# Altium schematic sheet HA_Power.SchDoc: transc
size A4; Date: 11/21/2016 9:12:52 PM; SheetNumber: 2; PageSetup: Record=PageOptions|CenterHorizontal=True|CenterVertical=True|PrintScale=0.98|XCorrection=1.00|YCorrection=1.00|PrintKind=0|BorderSize=5000000|LeftOffset=0|BottomOffset=0|Orientation=2|PaperLength=1000|PaperWidth=1000|Scale=100|PaperSource=7|PrintQuality=-3|MediaType=1|DitherType=10|PrintScaleMode=1|PaperKind=A4|PaperIndex=9
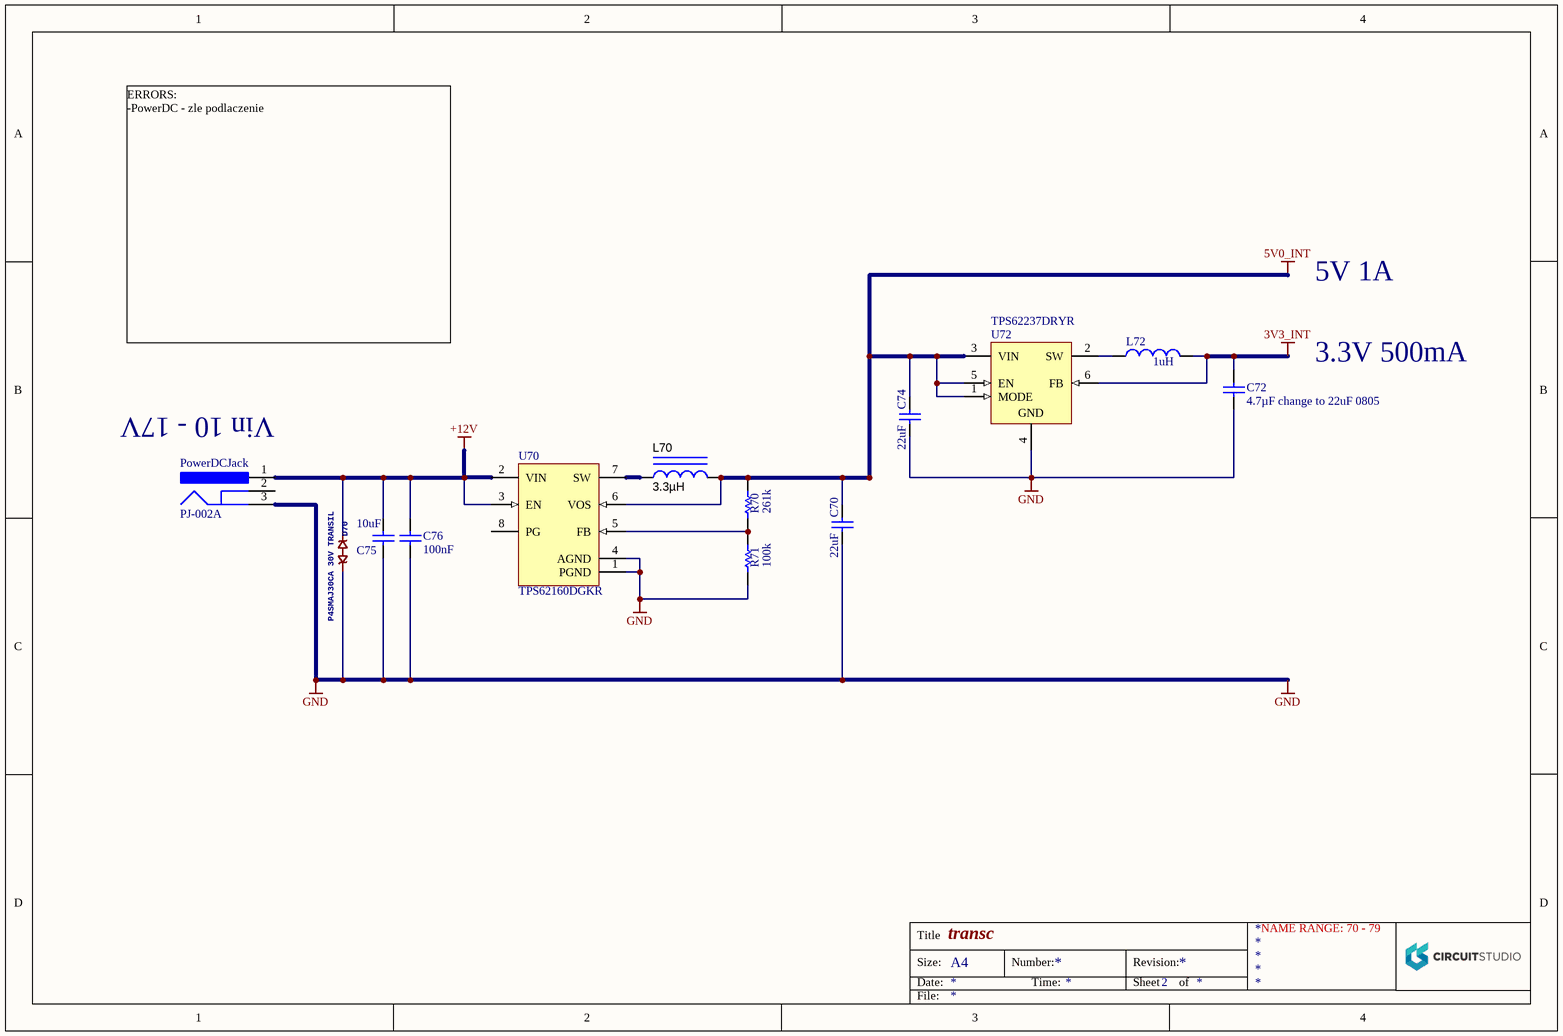
[diagram p0: HA_Power.SchDoc]

## Parts
C70  value 22uF  [CAPC0805(2012)75_N]  (hidden comment: 22uF 10V)
C72  Capacitance: 4.7µF change to 22uF 0805  [CAPC1608X95X30NL15T20]  (hidden comment: 4.7uF CL10B475KQ8NQNC)
C74  value 22uF  [CAPC0805(2012)75_N]  (hidden comment: 22uF 10V)
C75  value 10uF  [CAPC1206(3216)190_N]  (hidden comment: 10uF 35V)
C76  value 100nF  [CAPC0603(1608)100_L]  (hidden comment: 100nF 100V)
D70  P4SMAJ30CA 30V TRANSIL  [DO214AC_BIDIR]
L70  ValueDisplayed: 3.3µH  [XPL2010]  (hidden comment: 3.3uH XPL2010-332MLB)
L72  Inductance: 1uH  [MURA-IND0805_H_0.55_M]  (hidden comment: LQM21PN2R2MC0D)
PowerDCJack  PJ-002A  [CUI-PJ-002A_V]
R70  261k  [RESC0603(1608)_N]
R71  100k  [RESC0603(1608)_N]
U70  TPS62160DGKR  [DGK8_N]
U72  TPS62237DRYR  [DRY0006A]

## Nets
3V3_INT: C72.2 L72.2 U72.6(FB)
5V0_INT: C70.2 C74.2 L70.2 R70.2 U70.6(VOS) U72.1(MODE) U72.3(VIN) U72.5(EN)
+12V: C75.2 C76.1 D70.2 PowerDCJack.1 U70.2(VIN) U70.3(EN)
GND: C70.1 C72.1 C74.1 C75.1 C76.2 D70.1 PowerDCJack.3 R71.1 U70.1(PGND) U70.4(AGND) U72.4(GND)
NetL70_1: L70.1 U70.7(SW)
NetL72_1: L72.1 U72.2(SW)
NetR70_1: R70.1 R71.2 U70.5(FB)

Not connected (* = marked no-connect by the designer): PowerDCJack 2; U70 8(PG)

## Notes on the sheet
- 5V 1A
- ERRORS:
  -PowerDC - zle podlaczenie
- 3.3V 500mA
- (near PowerDCJack) Vin 10 - 17V
- NAME RANGE: 70 - 79
- Title
- Size:
- Date:
- A4
- Number:
- Time:
- Revision:
- Sheet
- of
- File:

## Library data of the parts
C70 C74 = CMP-1036-00417-1: Case-EIA: 0805; Tolerance: ±10%; Case-Metric: 2012; Technology: SMT; Max Thickness: 0.75 mm; Rated Voltage: 10 V
C72 = CMP-2000-06096-1: Manufacturer: Samsung Electro-Mechanics; Temperature Coefficient: X7R; Other Names: 1276-2087-2; Featured Product: Multi-LayerCeramicCapacitors; Voltage - Rated: 6.3V; Tolerance: ±10%; Product Training Modules: AutoGradeMLCCHighCapMLCCFamilySoftTerminationMLCC; Online Catalog: CLSeries,HighCapacitance; RoHS Information: MLCCRoHS2Compliance; Package / Case: 0603(1608Metric); Datasheet URL: http://media.digikey.com/pdf/Data%20Sheets/Samsung%20PDFs/CL10B475KQ8NQNC_Spec.pdf; Family: CeramicCapacitors; Category: Capacitors; Packaging: Tape&Reel(TR); Operating Temperature: -55°C~125°C; Datasheet Version: 09/2013; Lead Spacing: -; Mounting Type: SurfaceMount,MLCC; Ratings: -; Applications: GeneralPurpose; Height - Seated (Max): -; Series: CL; Package Reference: 0603; Manufacturer URL: http://www.samsungsem.com/global/index.jsp; Thickness (Max): 0.035"(0.90mm); Lead Style: -; Package Description: 2-Pin Surface Mount Device, Body 1.6 x 0.8 mm; Size / Dimension: 0.063"Lx0.031"W(1.60mmx0.80mm); Features: -; Mounting Technology: SurfaceMount; Standard Package: 4,000
C75 = CMP-1037-04990-1: CAP 1206 (3216 Metric) Thickness 1.9mm SMD; Rated Voltage: 10 V; Tolerance: Â±20%; Case-EIA: 1206; Case-Metric: 3216; Max Thickness: 1.9 mm; Technology: SMT
C76 = CMP-1035-00529-1: CAP 100nF 100V ±10% 0603 (1608 Metric) Thickness 1mm SMD; Case-Metric: 1608; Case-EIA: 0603; Rated Voltage: 100 V; Max Thickness: 1 mm; Technology: SMT; Tolerance: ±10%
D70 = DIODE_BIDIR-DO214AC
L70 = XPL2010-332MLB: XPL2010 Inductor; Manufacturer: Coilcraft; Ind_H: 3.3E-6; Imax_A: 1.05; Irms: 1.1A @ 40C rise; Isat: 1.05A @ 30% inductance drop; DCR_ohm: 0.21; Value1: 0.21 ohm; Value2: 1.05A; Material: Composite; SizeAreaWB_mm2: 8.7; SizeArea_mm2: 3.8; SizeX_mm: 2; SizeY_mm: 1.9; SizeZ_mm: 1; AEC Category: Q200; SymbolVersion: 2008-07-23; CompType: Inductor; Value: 3.3uH; PartNumber: XPL2010-332MLB; Technology: Shielded; MountType: SMT; PackageReference: XPL2010; Published: 2008-06-26; Publisher: Texas Instruments; LatestRevisionDate: 2016-12-22; ComponentLink1Description: Datasheet link; ComponentLink1URL: http://www.coilcraft.com/pdfs/xpl2010.pdf; RoHS: Y; AEC Qualified: ?
L72 = CMP-2000-06589-1: Chip Inductor, 1.0 uH, +/- 20%, -55 to 125 degC, 2-Pin SMD (0805), RoHS, Tape and Reel; Manufacturer: Murata; Rated Current-Max: 800mA; DC Resistance: 0.19; Mounting Technology: SurfaceMount; Package Reference: 0805; Tolerance (%): 20%; Datasheet Version: 07/2014; Manufacturer URL: http://www.murata.com/; Package Description: 2-Pin Surface Mounted Device, Body 2 x 1.25 mm; Case Size/Dimension: 0805; Datasheet URL: https://datasheet.ciiva.com/3866/336lqm21pn1r0mc023-3866307.pdf
PowerDCJack = CMP-2000-06895-1: Through Hole Right Angle DC Power Jack, 2.5 A, 2 mm Center Pin, 3 Position, -25 to 85 degC, RoHS, Bulk; Manufacturer: CUIInc.; Current Rating: 2.5A; Inside Contact Diameter: 2mm; Insulation Resistance: 50MOhms; Outside Contact Diameter: 6.5mm; Voltage Rating: 24V; Brand: CUI; Operating Temperature Range: -25Cto+85C; Mounting Technology: ThroughHole; Connector Type: DCPowerJack; Contact Material: Copper; Datasheet URL: http://www.cui.com/product/resource/pj-002a.pdf; Contact Gender: Male; Housing Material: PolybutyleneTerephthalate(PBT); Manufacturer URL: http://www.cui.com/; Package Reference: PJ-002A; Mounting Style: ThroughHole; Mounting Angle: Right; Product Category: DCPowerConnectors; Product: Jacks; Flammability Rating: UL94V-0; Contact Plating: Nickel; RoHS: True; Datasheet Version: Rev. 1.03, 04/2016; Package Description: 3-Pin Through Hole Device, Body 14.4 x 9 mm, Height 11 mm; Factory Pack Quantity: 500; Termination Style: ThroughHole
R70 R71 = CMP-1012-00122-1: 1% 0603 SMD; Value: 22k Ohm; Tolerance: 1 %
U70 = CMP-0323-00440-1: Buck Step Down Regulator with 3 to 17 V Input and 0.9 to 6 V Output, -40 to 85 degC, 8-Pin VSOP (DGK), Green (RoHS & no Sb/Br); Manufacturer: Texas Instruments; Regulated Outputs(#): 1; Vout(Min)(V): 0.9; Switch Current Limit(Typ)(A): 1.8; SubFamily: Step-Down Regulator; Vout(Max)(V): 6; Vin(Max)(V): 17; Iq(Typ)(mA): 0.017; Duty Cycle(Max)(%): 100; Synchronous Rectification: TRUE; Rating: Catalog; Vin(Min)(V): 3; PackageDescription: 8-Pin Thin Small Outline Package 3 x 3 mm Body ,0.65 mm Pitch; PackageVersion: revE, May-2006; PackageReference: DGK8; ComponentLink1URL: http://www.ti.com/general/docs/lit/getliterature.tsp?genericPartNumber=TPS62160&fileType=pdf; ComponentLink2Description: URL Link1; Iout(Max)(A): 1; ComponentLink1Description: Datasheet; Eco-Plan: Green (RoHS & no Sb/Br); Code_JEDEC: MO-187-AA; Topology: Buck; PartNumber: TPS62160DGKR; ComponentLink2URL: Samples URL:http://www.ti.com/product/tps62160#samples; DatasheetVersion: SLVSAM2A; Mounting Technology: Surface Mount
U72 = CMP-0323-00243-3: Buck Step Down Regulator with 2.05 to 6 V Input and 3.3 V Output, -40 to 85 degC, 6-Pin SON (DRY), Green (RoHS & no Sb/Br); Manufacturer: Texas Instruments; Vout(Max)(V): 3.3; Switch Current Limit(Typ)(A): 0.84; Iq(Typ)(mA): 0.022; Iout(Max)(A): 0.5; Synchronous Rectification: TRUE; Regulated Outputs(#): 1; Vin(Min)(V): 2.05; SubFamily: Step-Down Regulator; Rating: Catalog; Duty Cycle(Max)(%): 100; Vin(Max)(V): 6; PackageReference: DRY0006A; PartNumber: TPS62237DRYR; Mounting Technology: Surface Mount; Preset Vout(V): 3.3; Topology: Buck; DatasheetVersion: SLVS941E; ComponentLink2Description: Package Specification; PackageVersion: revF, Dec-2011; PackageDescription: 6-Pin Plastic Small Outline No-Lead, 1 x 1.45 x 0.6 mm Body, 0.5 mm Pitch; ComponentLink3Description: URL Link1; ComponentLink1Description: Datasheet; Eco-Plan: Green (RoHS & no Sb/Br); ComponentLink2URL: http://www.ti.com/litv/pdf/mpds221e; ComponentLink1URL: http://www.ti.com/general/docs/lit/getliterature.tsp?genericPartNumber=TPS62237&fileType=pdf; Vout(Min)(V): 3.3; ComponentLink3URL: Samples URL:http://www.ti.com/product/tps62237#samples